# Altium schematic sheet StepperMotorDrivers.SchDoc
size C; SPICEModelCacheXNHKODXI: <root> / <DocumentId>XNHKODXI</DocumentId> / </root>
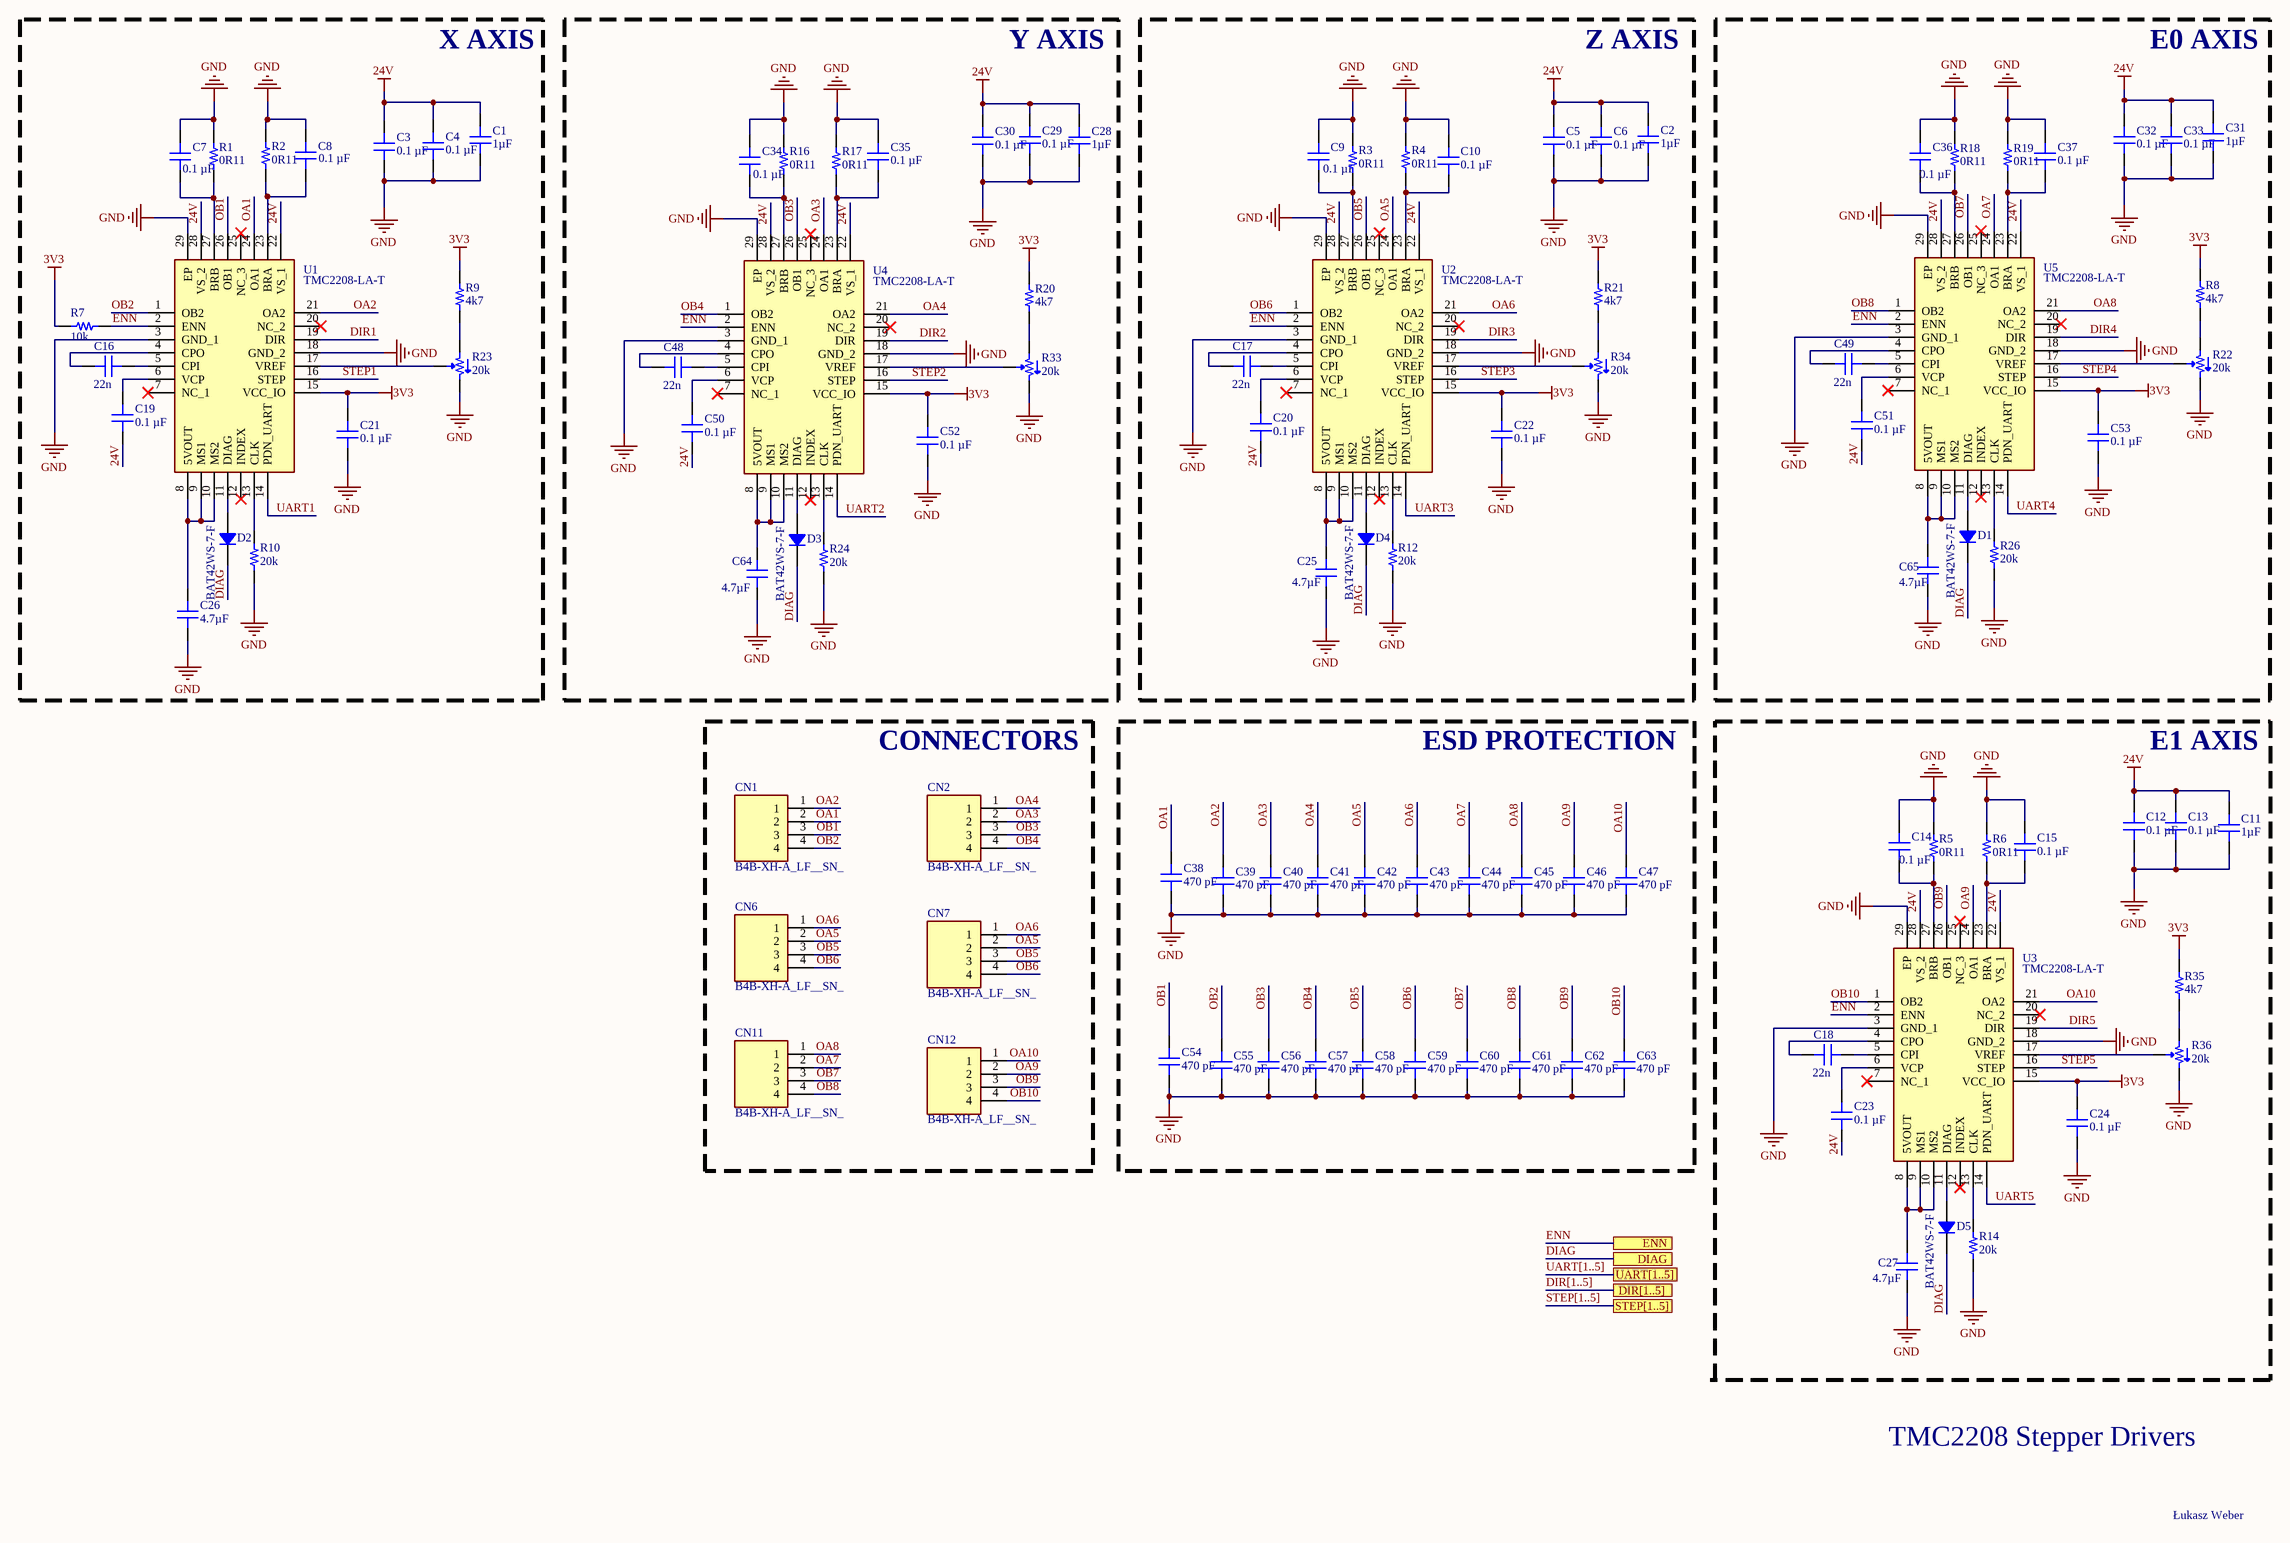
[diagram p0: StepperMotorDrivers.SchDoc]

## Parts
C1  1µF  [CAP 0603_1608]
C2  1µF  [CAP 0603_1608]
C3  0.1 µF  [CAP 0603_1608]
C4  0.1 µF  [CAP 0603_1608]
C5  0.1 µF  [CAP 0603_1608]
C6  0.1 µF  [CAP 0603_1608]
C7  0.1 µF  [CAP 0603_1608]
C8  0.1 µF  [CAP 0603_1608]
C9  0.1 µF  [CAP 0603_1608]
C10  0.1 µF  [CAP 0603_1608]
C11  1µF  [CAP 0603_1608]
C12  0.1 µF  [CAP 0603_1608]
C13  0.1 µF  [CAP 0603_1608]
C14  0.1 µF  [CAP 0603_1608]
C15  0.1 µF  [CAP 0603_1608]
C16  22n  [CAP 0603_1608]
C17  22n  [CAP 0603_1608]
C18  22n  [CAP 0603_1608]
C19  0.1 µF  [CAP 0603_1608]
C20  0.1 µF  [CAP 0603_1608]
C21  0.1 µF  [CAP 0603_1608]
C22  0.1 µF  [CAP 0603_1608]
C23  0.1 µF  [CAP 0603_1608]
C24  0.1 µF  [CAP 0603_1608]
C25  4.7µF  [CAP 0603_1608]
C26  4.7µF  [CAP 0603_1608]
C27  4.7µF  [CAP 0603_1608]
C28  1µF  [CAP 0603_1608]
C29  0.1 µF  [CAP 0603_1608]
C30  0.1 µF  [CAP 0603_1608]
C31  1µF  [CAP 0603_1608]
C32  0.1 µF  [CAP 0603_1608]
C33  0.1 µF  [CAP 0603_1608]
C34  0.1 µF  [CAP 0603_1608]
C35  0.1 µF  [CAP 0603_1608]
C36  0.1 µF  [CAP 0603_1608]
C37  0.1 µF  [CAP 0603_1608]
C38  470 pF  [CAP 0603_1608]
C39  470 pF  [CAP 0603_1608]
C40  470 pF  [CAP 0603_1608]
C41  470 pF  [CAP 0603_1608]
C42  470 pF  [CAP 0603_1608]
C43  470 pF  [CAP 0603_1608]
C44  470 pF  [CAP 0603_1608]
C45  470 pF  [CAP 0603_1608]
C46  470 pF  [CAP 0603_1608]
C47  470 pF  [CAP 0603_1608]
C48  22n  [CAP 0603_1608]
C49  22n  [CAP 0603_1608]
C50  0.1 µF  [CAP 0603_1608]
C51  0.1 µF  [CAP 0603_1608]
C52  0.1 µF  [CAP 0603_1608]
C53  0.1 µF  [CAP 0603_1608]
C54  470 pF  [CAP 0603_1608]
C55  470 pF  [CAP 0603_1608]
C56  470 pF  [CAP 0603_1608]
C57  470 pF  [CAP 0603_1608]
C58  470 pF  [CAP 0603_1608]
C59  470 pF  [CAP 0603_1608]
C60  470 pF  [CAP 0603_1608]
C61  470 pF  [CAP 0603_1608]
C62  470 pF  [CAP 0603_1608]
C63  470 pF  [CAP 0603_1608]
C64  4.7µF  [CAP 0603_1608]
C65  4.7µF  [CAP 0603_1608]
CN1  B4B-XH-A_LF__SN_  [B4BXHALFSN]
CN2  B4B-XH-A_LF__SN_  [B4BXHALFSN]
CN6  B4B-XH-A_LF__SN_  [B4BXHALFSN]
CN7  B4B-XH-A_LF__SN_  [B4BXHALFSN]
CN11  B4B-XH-A_LF__SN_  [B4BXHALFSN]
CN12  B4B-XH-A_LF__SN_  [B4BXHALFSN]
D1  BAT42WS-7-F  [SOD323]
D2  BAT42WS-7-F  [SOD323]
D3  BAT42WS-7-F  [SOD323]
D4  BAT42WS-7-F  [SOD323]
D5  BAT42WS-7-F  [SOD323]
R1  0R11  [RES 0805_2012]
R2  0R11  [RES 0805_2012]
R3  0R11  [RES 0805_2012]
R4  0R11  [RES 0805_2012]
R5  0R11  [RES 0805_2012]
R6  0R11  [RES 0805_2012]
R7  10k  [RES 0603_1608]
R8  4k7  [RES 0603_1608]
R9  4k7  [RES 0603_1608]
R10  20k  [RES 0603_1608]
R12  20k  [RES 0603_1608]
R14  20k  [RES 0603_1608]
R16  0R11  [RES 0805_2012]
R17  0R11  [RES 0805_2012]
R18  0R11  [RES 0805_2012]
R19  0R11  [RES 0805_2012]
R20  4k7  [RES 0603_1608]
R21  4k7  [RES 0603_1608]
R22  20k  [POT BOURNS TRIMPOT TC33]
R23  20k  [POT BOURNS TRIMPOT TC33]
R24  20k  [RES 0603_1608]
R26  20k  [RES 0603_1608]
R33  20k  [POT BOURNS TRIMPOT TC33]
R34  20k  [POT BOURNS TRIMPOT TC33]
R35  4k7  [RES 0603_1608]
R36  20k  [POT BOURNS TRIMPOT TC33]
U1  TMC2208-LA-T  [QFN50P500X500X90-29N-D]
U2  TMC2208-LA-T  [QFN50P500X500X90-29N-D]
U3  TMC2208-LA-T  [QFN50P500X500X90-29N-D]
U4  TMC2208-LA-T  [QFN50P500X500X90-29N-D]
U5  TMC2208-LA-T  [QFN50P500X500X90-29N-D]

## Blocks framed on the sheet
X AXIS: C1 C3 C4 C7 C8 C16 C19 C21 C26 D2 R1 R2 R7 R9 R10 R23 U1
Y AXIS: C28-C30 C34 C35 C48 C50 C52 C64 D3 R16 R17 R20 R24 R33 U4
Z AXIS: C2 C5 C6 C9 C10 C17 C20 C22 C25 D4 R3 R4 R12 R21 R34 U2
E0 AXIS: C31-C33 C36 C37 C49 C51 C53 C65 D1 R8 R18 R19 R22 R26 U5
CONNECTORS: CN1 CN2 CN6 CN7 CN11 CN12
ESD PROTECTION: C38-C47 C54-C63

## Ports
DIAG, DIR[1..5], ENN, STEP[1..5], UART[1..5]

## Nets
3V3: C21.2 C22.2 C24.2 C52.2 C53.2 R7.2 R8.1 R9.1 R20.1 R21.1 R35.1 U1.15(VCC_IO) U2.15(VCC_IO) U3.15(VCC_IO) U4.15(VCC_IO) U5.15(VCC_IO)
24V: C1.2 C2.2 C3.2 C4.2 C5.2 C6.2 C11.2 C12.2 C13.2 C19.1 C20.1 C23.1 C28.2 C29.2 C30.2 C31.2 C32.2 C33.2 C50.1 C51.1 U1.22(VS_1) U1.28(VS_2) U2.22(VS_1) U2.28(VS_2) U3.22(VS_1) U3.28(VS_2) U4.22(VS_1) U4.28(VS_2) U5.22(VS_1) U5.28(VS_2)
GND: C1.1 C2.1 C3.1 C4.1 C5.1 C6.1 C7.2 C8.2 C9.2 C10.2 C11.1 C12.1 C13.1 C14.2 C15.2 C21.1 C22.1 C24.1 C25.1 C26.1 C27.1 C28.1 C29.1 C30.1 C31.1 C32.1 C33.1 C34.2 C35.2 C36.2 C37.2 C38.1 C39.1 C40.1 C41.1 C42.1 C43.1 C44.1 C45.1 C46.1 C47.1 C52.1 C53.1 C54.1 C55.1 C56.1 C57.1 C58.1 C59.1 C60.1 C61.1 C62.1 C63.1 C64.1 C65.1 R1.2 R2.2 R3.2 R4.2 R5.2 R6.2 R10.1 R12.1 R14.1 R16.2 R17.2 R18.2 R19.2 R22.3 R23.3 R24.1 R26.1 R33.3 R34.3 R36.3 U1.3(GND_1) U1.18(GND_2) U1.29(EP) U2.3(GND_1) U2.18(GND_2) U2.29(EP) U3.3(GND_1) U3.18(GND_2) U3.29(EP) U4.3(GND_1) U4.18(GND_2) U4.29(EP) U5.3(GND_1) U5.18(GND_2) U5.29(EP)
DIAG: D1.2 D2.2 D3.2 D4.2 D5.2 ; port DIAG
DIR1: U1.19(DIR)
DIR2: U4.19(DIR)
DIR3: U2.19(DIR)
DIR4: U5.19(DIR)
DIR5: U3.19(DIR)
ENN: R7.1 U1.2(ENN) U2.2(ENN) U3.2(ENN) U4.2(ENN) U5.2(ENN) ; port ENN
OA1: C38.2 CN1.2 U1.24(OA1)
OA2: C39.2 CN1.1 U1.21(OA2)
OA3: C40.2 CN2.2 U4.24(OA1)
OA4: C41.2 CN2.1 U4.21(OA2)
OA5: C42.2 CN6.2 CN7.2 U2.24(OA1)
OA6: C43.2 CN6.1 CN7.1 U2.21(OA2)
OA7: C44.2 CN11.2 U5.24(OA1)
OA8: C45.2 CN11.1 U5.21(OA2)
OA9: C46.2 CN12.2 U3.24(OA1)
OA10: C47.2 CN12.1 U3.21(OA2)
OB1: C54.2 CN1.3 U1.26(OB1)
OB2: C55.2 CN1.4 U1.1(OB2)
OB3: C56.2 CN2.3 U4.26(OB1)
OB4: C57.2 CN2.4 U4.1(OB2)
OB5: C58.2 CN6.3 CN7.3 U2.26(OB1)
OB6: C59.2 CN6.4 CN7.4 U2.1(OB2)
OB7: C60.2 CN11.3 U5.26(OB1)
OB8: C61.2 CN11.4 U5.1(OB2)
OB9: C62.2 CN12.3 U3.26(OB1)
OB10: C63.2 CN12.4 U3.1(OB2)
STEP1: U1.16(STEP)
STEP2: U4.16(STEP)
STEP3: U2.16(STEP)
STEP4: U5.16(STEP)
STEP5: U3.16(STEP)
UART1: U1.14(PDN_UART)
UART2: U4.14(PDN_UART)
UART3: U2.14(PDN_UART)
UART4: U5.14(PDN_UART)
UART5: U3.14(PDN_UART)
NetC7_1: C7.1 R1.1 U1.27(BRB)
NetC8_1: C8.1 R2.1 U1.23(BRA)
NetC9_1: C9.1 R3.1 U2.27(BRB)
NetC10_1: C10.1 R4.1 U2.23(BRA)
NetC14_1: C14.1 R5.1 U3.27(BRB)
NetC15_1: C15.1 R6.1 U3.23(BRA)
NetC16_1: C16.1 U1.4(CPO)
NetC16_2: C16.2 U1.5(CPI)
NetC17_1: C17.1 U2.4(CPO)
NetC17_2: C17.2 U2.5(CPI)
NetC18_1: C18.1 U3.4(CPO)
NetC18_2: C18.2 U3.5(CPI)
NetC19_2: C19.2 U1.6(VCP)
NetC20_2: C20.2 U2.6(VCP)
NetC23_2: C23.2 U3.6(VCP)
NetC25_2: C25.2 U2.8(5VOUT) U2.9(MS1) U2.10(MS2)
NetC26_2: C26.2 U1.8(5VOUT) U1.9(MS1) U1.10(MS2)
NetC27_2: C27.2 U3.8(5VOUT) U3.9(MS1) U3.10(MS2)
NetC34_1: C34.1 R16.1 U4.27(BRB)
NetC35_1: C35.1 R17.1 U4.23(BRA)
NetC36_1: C36.1 R18.1 U5.27(BRB)
NetC37_1: C37.1 R19.1 U5.23(BRA)
NetC48_1: C48.1 U4.4(CPO)
NetC48_2: C48.2 U4.5(CPI)
NetC49_1: C49.1 U5.4(CPO)
NetC49_2: C49.2 U5.5(CPI)
NetC50_2: C50.2 U4.6(VCP)
NetC51_2: C51.2 U5.6(VCP)
NetC64_2: C64.2 U4.8(5VOUT) U4.9(MS1) U4.10(MS2)
NetC65_2: C65.2 U5.8(5VOUT) U5.9(MS1) U5.10(MS2)
NetD1_1: D1.1 U5.11(DIAG)
NetD2_1: D2.1 U1.11(DIAG)
NetD3_1: D3.1 U4.11(DIAG)
NetD4_1: D4.1 U2.11(DIAG)
NetD5_1: D5.1 U3.11(DIAG)
NetR8_2: R8.2 R22.1
NetR9_2: R9.2 R23.1
NetR10_2: R10.2 U1.13(CLK)
NetR12_2: R12.2 U2.13(CLK)
NetR14_2: R14.2 U3.13(CLK)
NetR20_2: R20.2 R33.1
NetR21_2: R21.2 R34.1
NetR22_2: R22.2 U5.17(VREF)
NetR23_2: R23.2 U1.17(VREF)
NetR24_2: R24.2 U4.13(CLK)
NetR26_2: R26.2 U5.13(CLK)
NetR33_2: R33.2 U4.17(VREF)
NetR34_2: R34.2 U2.17(VREF)
NetR35_2: R35.2 R36.1
NetR36_2: R36.2 U3.17(VREF)

Not connected (* = marked no-connect by the designer): U1 7(NC_1)* 12(INDEX)* 20(NC_2)* 25(NC_3)*; U2 7(NC_1)* 12(INDEX)* 20(NC_2)* 25(NC_3)*; U3 7(NC_1)* 12(INDEX)* 20(NC_2)* 25(NC_3)*; U4 7(NC_1)* 12(INDEX)* 20(NC_2)* 25(NC_3)*; U5 7(NC_1)* 12(INDEX)* 20(NC_2)* 25(NC_3)*

## Buses and harness runs
bus DIR[1..5] = port DIR[1..5]
bus STEP[1..5] = port STEP[1..5]
bus UART[1..5] = port UART[1..5]

## Notes on the sheet
- E1 AXIS
- TMC2208 Stepper Drivers
- Łukasz Weber

## Library data of the parts
C1 C2 C11 C28 C31 = 06035C105KAT2A: CAP CER 1UF 50V X7R 0603; manufacturer: AVX Corporation; Tolerance: ±10%; Part Number: 06035C105KAT2A; Value: 1µF; Applications: General Purpose; Capacitance: 1µF; componentlink1description: Datasheet; componentlink1url: http://datasheets.avx.com/X7RDielectric.pdf; componentlink2description: DigiKey Link; componentlink2url: http://digikey.com/product-detail/en/avx-corporation/06035C105KAT2A/478-10073-1-ND/6564295; Device Package: 0603 (1608 Metric); lastupdated: 9/2/2020 1:03:35 AM; Lifecycle Status: Active; Minimum Order: 1; Mounting Type: Surface Mount, MLCC; Operating Temperature: -55°C ~ 125°C; Package / Case: 0603 (1608 Metric); packaging: TapeAndReel; partid: 2905; Part Status: Active; price: 0.15; series: -; Size / Dimension: 0.063" L x 0.032" W (1.60mm x 0.81mm); Supplier 1: DigiKey; Supplier Part Number 1: 478-10073-1-ND; Temperature Coefficient: X7R; Thickness (Max): 0.020" (0.50mm); Voltage - Rated: 50V
C3-C10 C12-C15 C19-C24 C29 C30 C32-C37 C50-C53 = 0603B104K101CT: CAP CER 0.1UF 100V X7R 0603; manufacturer: Walsin Technology Corporation; Tolerance: ±10%; Part Number: 0603B104K101CT; Value: 0.1 µF; Applications: General Purpose; Capacitance: 0.1 µF; componentlink1description: Datasheet; componentlink1url: http://www.passivecomponent.com/wp-content/uploads/2018/10/MLCC.pdf; componentlink2description: DigiKey Link; componentlink2url: https://www.digikey.com/en/products/detail/walsin-technology-corporation/0603B104K101CT/9354889; Device Package: 0603 (1608 Metric); lastupdated: 4/8/2023 7:09:18 PM; Lifecycle Status: Active; Minimum Order: 1; Mounting Type: Surface Mount, MLCC; Operating Temperature: -55°C ~ 125°C; Package / Case: 0603 (1608 Metric); packaging: TapeAndReel; partid: 4273; Part Status: Active; price: 0.01; series: -; Size / Dimension: 0.063" L x 0.031" W (1.60mm x 0.80mm); Supplier 1: DigiKey; Supplier Part Number 1: 1292-1392-1-ND; Temperature Coefficient: X7R; Thickness (Max): 0.037" (0.95mm); Voltage - Rated: 100V
C16-C18 C48 C49 = C0603C222G5GAC7867: CAP CER 2200PF 50V NP0 0603; manufacturer: KEMET; Temperature Coefficient: C0G, NP0; Tolerance: ±2%; Part Number: C0603C222G5GAC7867; Value: 22n; Applications: General Purpose; Capacitance: 2200 pF; componentlink1description: Datasheet; componentlink1url: https://api.kemet.com/component-edge/download/datasheet/C0603C222G5GACTU.pdf; componentlink2description: DigiKey Link; componentlink2url: https://www.digikey.com/en/products/detail/kemet/C0603C222G5GAC7867/2200244; Device Package: 0603 (1608 Metric); Features: Low ESL; lastupdated: 4/8/2023 7:08:51 PM; Lifecycle Status: Active; Minimum Order: 1; Mounting Type: Surface Mount, MLCC; Operating Temperature: -55°C ~ 125°C; Package / Case: 0603 (1608 Metric); packaging: TapeAndReel; partid: 12773; Part Status: Active; price: 0.18; series: SMD Comm C0G; Size / Dimension: 0.063" L x 0.031" W (1.60mm x 0.80mm); Supplier 1: DigiKey; Supplier Part Number 1: 399-14503-1-ND; Thickness (Max): 0.034" (0.87mm); Voltage - Rated: 50V
C25-C27 C64 C65 = 06036D475MAT2A: CAP CER 4.7UF 6.3V X5R 0603; manufacturer: AVX Corporation; Tolerance: ±20%; Part Number: 06036D475MAT2A; Value: 4.7µF; Applications: General Purpose; Capacitance: 4.7µF; componentlink1description: Datasheet; componentlink1url: http://datasheets.avx.com/cx5r.pdf; componentlink2description: DigiKey Link; componentlink2url: http://digikey.com/product-detail/en/avx-corporation/06036D475MAT2A/478-2582-1-ND/717527; Device Package: 0603 (1608 Metric); lastupdated: 9/2/2020 1:03:34 AM; Lifecycle Status: Active; Minimum Order: 1; Mounting Type: Surface Mount, MLCC; Operating Temperature: -55°C ~ 85°C; Package / Case: 0603 (1608 Metric); packaging: CutTape; partid: 2938; Part Status: Active; price: 0.81; series: -; Size / Dimension: 0.063" L x 0.032" W (1.60mm x 0.81mm); Supplier 1: DigiKey; Supplier Part Number 1: 478-2582-1-ND; Temperature Coefficient: X5R; Thickness (Max): 0.035" (0.90mm); Voltage - Rated: 6.3V
C38-C47 C54-C63 = C0603X471J5RAC7867: CAP CER 0603 470PF 5% X7R 50V FL; manufacturer: KEMET; Part Number: C0603X471J5RAC7867; Value: 470 pF; Applications: Boardflex Sensitive; Capacitance: 470 pF; componentlink1description: Datasheet; componentlink1url: https://api.kemet.com/component-edge/download/datasheet/C0603X471J5RAC7867.pdf; componentlink2description: DigiKey Link; componentlink2url: https://www.digikey.com/en/products/detail/kemet/C0603X471J5RAC7867/8572446; Device Package: 0603 (1608 Metric); Features: Soft Termination; lastupdated: 4/8/2023 7:09:16 PM; Lifecycle Status: Active; Minimum Order: 1; Mounting Type: Surface Mount, MLCC; Operating Temperature: -55°C ~ 125°C; Package / Case: 0603 (1608 Metric); packaging: TapeAndReel; partid: 4946; Part Status: Active; price: 0.09; series: SMD Comm X7R Flex; Size / Dimension: 0.063" L x 0.031" W (1.60mm x 0.80mm); Supplier 1: DigiKey; Supplier Part Number 1: 399-17611-1-ND; Temperature Coefficient: X7R; Thickness (Max): 0.037" (0.95mm); Tolerance: ±5%; Voltage - Rated: 50V
CN1 CN2 CN6 CN7 CN11 CN12 = B4B-XH-A_LF__SN_: Connector; Manufacturer_Name: JST (JAPAN SOLDERLESS TERMINALS); Manufacturer_Part_Number: B4B-XH-A(LF)(SN); Datasheet Link: https://datasheet.lcsc.com/szlcsc/JST-Sales-America-B4B-XH-A-LF-SN_C144395.pdf; Height: 7mm; Arrow Part Number: B4B-XH-A(LF)(SN); Arrow Price/Stock: https://www.arrow.com/en/products/b4b-xh-a-lf-sn/jst-manufacturing?region=europe
D1-D5 = BAT42WS-7-F: DIODE SCHOTTKY 30V 200MA SOD323; Manufacturer: Diodes Incorporated; Capacitance @ Vr, F: 10pF @ 1V, 1MHz; Current - Reverse Leakage @ Vr: 500 nA @ 25 V; Reverse Recovery Time (trr): 5 ns; Speed: Small Signal =< 200mA (Io), Any Speed; Voltage - Forward (Vf) (Max) @ If: 1 V @ 200 mA; Part Number: BAT42WS-7-F; ComponentLink1Description: Datasheet; ComponentLink1URL: https://www.diodes.com/assets/Datasheets/ds30100.pdf; ComponentLink2Description: DigiKey Link; ComponentLink2URL: https://www.digikey.com/en/products/detail/diodes-incorporated/BAT42WS-7-F/806536; Current - Average Rectified (Io): 200mA; Diode Type: Schottky; LastUpdated: 9/7/2023 8:41:08 PM; Lifecycle Status: Active; Minimum Order: 1; Mounting Type: Surface Mount; Operating Temperature - Junction: -55°C ~ 125°C; Package / Case: SC-76, SOD-323; Packaging: TapeAndReel; PartId: 3090; Part Status: Active; Price: 0.06; Series: -; Supplier 1: DigiKey; Supplier Part Number 1: BAT42WS-FDICT-ND; Supplier Device Package: SOD-323; Voltage - DC Reverse (Vr) (Max): 30 V
R1-R6 R16-R19 = ERJ-U6SFR15V: RES 0.15 OHM 1% 1/4W 0805; Manufacturer: Panasonic Electronic Components; Power (Watts): 0.25W, 1/4W; Resistance: 150 mOhms; Temperature Coefficient: ±150ppm/°C; Part Number: ERJ-U6SFR15V; Value: 0R11; ComponentLink1Description: Datasheet; ComponentLink1URL: https://industrial.panasonic.com/cdbs/www-data/pdf/RDP0000/AOA0000C334.pdf; ComponentLink2Description: DigiKey Link; ComponentLink2URL: https://www.digikey.com/en/products/detail/panasonic-electronic-components/ERJ-U6SFR15V/2811826; Composition: Thick Film; Device Package: 0805 (2012 Metric); Features: Anti-Sulfur, Automotive AEC-Q200; Height - Seated (Max): 0.026" (0.65mm); LastUpdated: 6/24/2023 8:04:48 PM; Lifecycle Status: Active; Minimum Order: 1; Number of Terminations: 2; Operating Temperature: -55°C ~ 155°C; Package / Case: 0805 (2012 Metric); Packaging: TapeAndReel; PartId: 27705; Part Status: Active; Price: 0.08; Ratings: AEC-Q200; Series: ERJ-U6S; Size / Dimension: 0.079" L x 0.049" W (2.00mm x 1.25mm); Supplier 1: DigiKey; Supplier Part Number 1: 10-ERJ-U6SFR15VCT-ND; Supplier Device Package: 0805; Tolerance: ±1%
R7-R10 R12 R14 R20 R21 R24 R26 R35 = ERJ-UP3F2002V: RES 20K OHM 1% 1/4W 0603; Manufacturer: Panasonic Electronic Components; Power (Watts): 0.25W, 1/4W; Resistance: 20 kOhms; Temperature Coefficient: ±100ppm/°C; Part Number: ERJ-UP3F2002V; ComponentLink1Description: Datasheet; ComponentLink1URL: https://b2b-api.panasonic.eu/file_stream/pids/fileversion/4484; ComponentLink2Description: DigiKey Link; ComponentLink2URL: https://www.digikey.com/en/products/detail/panasonic-electronic-components/ERJ-UP3F2002V/12092896; Composition: Thick Film; Device Package: 0603 (1608 Metric); Features: Anti-Sulfur, Automotive AEC-Q200, Pulse Withstanding; Height - Seated (Max): 0.022" (0.55mm); LastUpdated: 4/8/2023 7:29:07 PM; Lifecycle Status: Active; Minimum Order: 1; Number of Terminations: 2; Operating Temperature: -55°C ~ 155°C; Package / Case: 0603 (1608 Metric); Packaging: TapeAndReel; PartId: 63566; Part Status: Active; Price: 0.03; Ratings: AEC-Q200; Series: ERJ-UP3; Size / Dimension: 0.063" L x 0.031" W (1.60mm x 0.80mm); Supplier 1: DigiKey; Supplier Part Number 1: 10-ERJ-UP3F2002VCT-ND; Supplier Device Package: 0603; Tolerance: ±1%
  R7: Value: 10k
  R8 R9 R20 R21 R35: Value: 4k7
  R10 R12 R14 R24 R26: Value: 20k
R22 R23 R33 R34 R36 = TC33X-2-203E: TRIMMER 20K OHM 0.1W J LEAD TOP; Manufacturer: Bourns Inc.; Adjustment Type: Top Adjustment; Number of Turns: 1; Power (Watts): 0.1W, 1/10W; Resistance: 20 kOhms; Resistive Material: Cermet; Temperature Coefficient: ±250ppm/°C; Tolerance: ±25%; Value: 20 kOhms; Part Number: TC33X-2-203E; ComponentLink1Description: Datasheet; ComponentLink1URL: https://www.bourns.com/docs/Product-Datasheets/TC33.pdf; ComponentLink2Description: DigiKey Link; ComponentLink2URL: https://www.digikey.com/en/products/detail/bourns-inc/TC33X-2-203E/2566887; LastUpdated: 9/7/2023 8:25:30 PM; Lifecycle Status: Active; Minimum Order: 1; Mounting Type: Surface Mount; Packaging: TapeAndReel; PartId: 12; Part Status: Active; Price: 0.11; Series: Trimpot® TC33 - Open Frame; Size / Dimension: Rectangular - 0.150" x 0.142" Face (3.80mm x 3.60mm); Supplier 1: DigiKey; Supplier Part Number 1: TC33X-2-203ECT-ND; Termination Style: J Lead
U1-U5 = TMC2208-LA-T: Integrated Circuit; Manufacturer_Name: TRINAMIC; Datasheet Link: https://datasheet.datasheetarchive.com/originals/distributors/DKDS-23/450911.pdf; Height: 0.9mm; Manufacturer_Part_Number: TMC2208-LA-T; Mouser Part Number: 700-TMC2208-LA-T; Mouser Price/Stock: https://www.mouser.co.uk/ProductDetail/Trinamic/TMC2208-LA-T?qs=TiOZkKH1s2TUCbyrI5xF3A%3D%3D